# EAGLE design PID temperature controller (EAGLE 9.6.2)
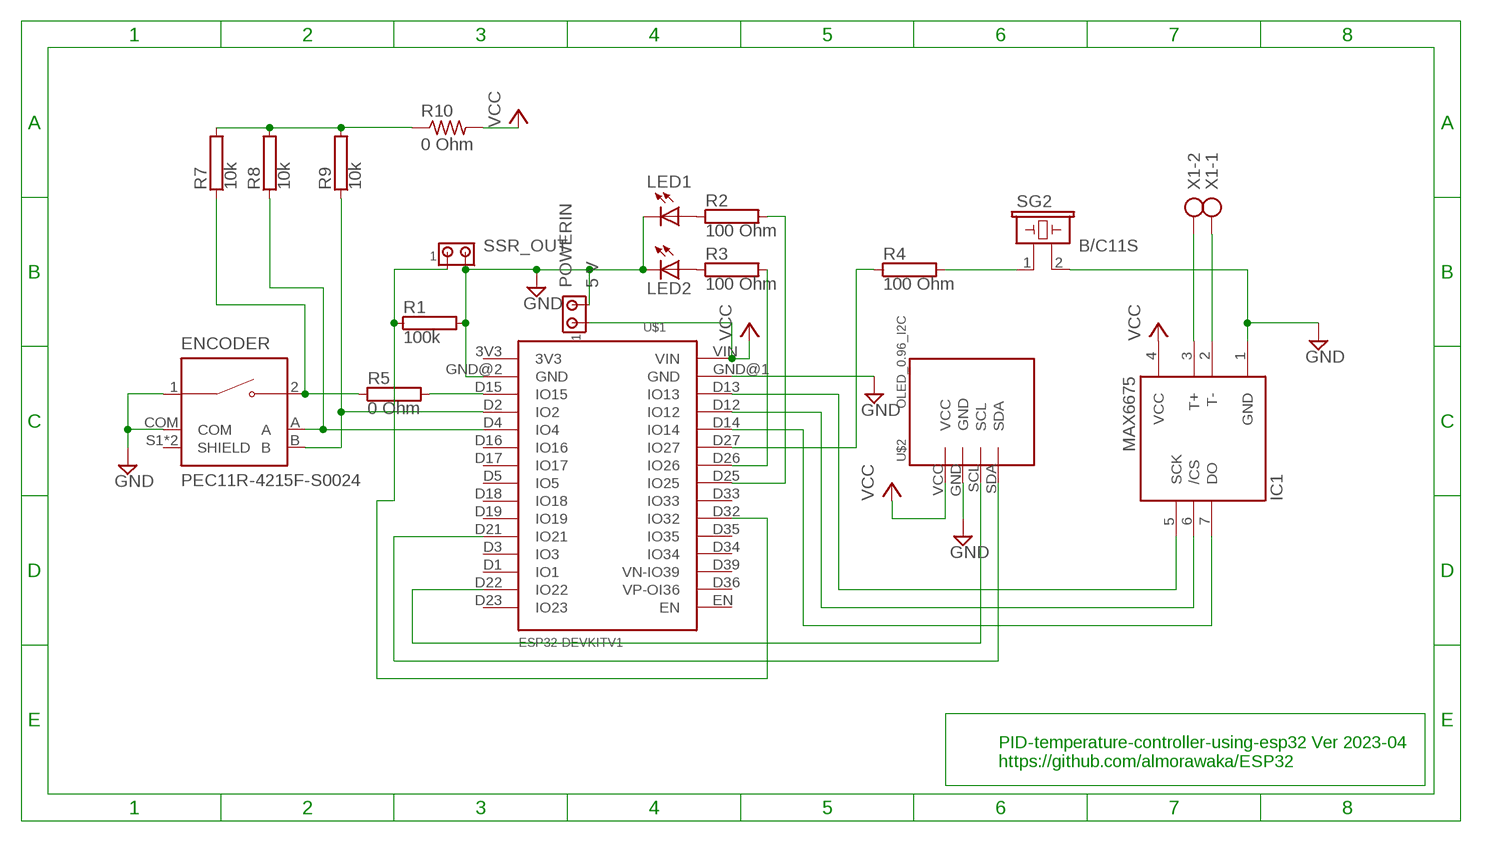
[diagram p0: schematic, sheet 1]

## Parts
ENCODER  PEC11R-4215F-S0024  [XDCR_PEC11R-4215F-S0024]
IC1  MAX6675  [SO08]
LED1  LED3MM  [LED3MM]
LED2  LED3MM  [LED3MM]
POWERIN  5 V  MTA02-100  [10X02MTA]
R1  100k  RRS1/8  [RS1/8]
R2  100 Ohm  RRS1/8  [RS1/8]
R3  100 Ohm  RRS1/8  [RS1/8]
R4  100 Ohm  RRS1/8  [RS1/8]
R5  0 Ohm  RRS1/8  [RS1/8]
R7  10k  RRS1/8  [RS1/8]
R8  10k  RRS1/8  [RS1/8]
R9  10k  RRS1/8  [RS1/8]
R10  0 Ohm  R-US_0207/12  [0207/12]
SG2  B/C11S  [B/C11S]
SSR_OUT  MTA02-100  [10X02MTA]
U$1  ESP32DEVKITV1  [ESP32-DEVKITV1]
U$2  OLED_0.96_I2C  [OLED_0.96_I2C]
X1  AK300/2  [AK300/2]

## Nets
GND: ENCODER.1 ENCODER.COM IC1.1(GND) LED1.K(C) LED2.K(C) POWERIN.2 R1.2 SG2.2 SSR_OUT.2 U$1.GND@1(GND) U$1.GND@2(GND) U$2.GND
N$1: IC1.7(DO) U$1.D14(IO14)
N$2: IC1.6(/CS) U$1.D12(IO12)
N$3: IC1.5(SCK) U$1.D13(IO13)
N$4: R4.1 U$1.D27(IO27)
N$5: IC1.3(T+) X1.2
N$6: IC1.2(T-) X1.1
N$7: U$1.D21(IO21) U$2.SDA
N$8: U$1.D22(IO22) U$2.SCL
N$9: R1.1 SSR_OUT.1 U$1.D32(IO32)
N$10: ENCODER.2 R5.1 R7.1
N$11: R5.2 U$1.D15(IO15)
N$13: LED1.A R2.1
N$14: LED2.A R3.1
N$15: R3.2 U$1.D26(IO26)
N$16: R2.2 U$1.D25(IO25)
N$17: R4.2 SG2.1
N$18: R7.2 R8.2 R9.2 R10.1
N$20: ENCODER.B R9.1 U$1.D2(IO2)
N$21: ENCODER.A R8.1 U$1.D4(IO4)
VCC: IC1.4(VCC) POWERIN.1 R10.2 U$1.VIN U$2.VCC
Unconnected: ENCODER.S1(SHIELD) ENCODER.S2(SHIELD) U$1.3V3 U$1.D1(IO1) U$1.D3(IO3) U$1.D5(IO5) U$1.D16(IO16) U$1.D17(IO17) U$1.D18(IO18) U$1.D19(IO19) U$1.D23(IO23) U$1.D33(IO33) U$1.D34(IO34) U$1.D35(IO35) U$1.D36(VP-OI36) U$1.D39(VN-IO39) U$1.EN

## Notes on the sheet
- PID-temperature-controller-using-esp32 Ver 2023-04
  https://github.com/almorawaka/ESP32

## Library data of the parts
ENCODER = rotary encoder:PEC11R-4215F-S0024: Incremental Encoder, 12 Mm, Contact Rating 10 Ma - 5 Vdc; DESCRIPTION: Rotary Encoder Mechanical 24 Quadrature (Incremental) Vertical; DIGI-KEY_PART_NUMBER: PEC11R-4215F-S0024-ND; MF: Bourns; MP: PEC11R-4215F-S0024; PACKAGE: None; PURCHASE-URL: https://pricing.snapeda.com/search/part/PEC11R-4215F-S0024/?ref=eda
IC1 = MAX6675:MAX6675: Check availability <https://pricing.snapeda.com/parts/MAX6675/Maxim%20Integrated/view-part?ref=eda>; AVAILABILITY: In Stock; DESCRIPTION: Temperature Sensor Development Tools Eval Kit MAX6675 (Cold-Junction-Compensated K-Thermocouple-to-DigitalConverter (0 C to +1024 C)); MF: Maxim Integrated; MP: MAX6675; PACKAGE: SOIC-8 Maxim; PRICE: None; PURCHASE-URL: https://pricing.snapeda.com/search/part/MAX6675/?ref=eda
LED1 LED2 = adafruit:LED: LED OSRAM: - CHIPLED LG R971, LG N971, LY N971, LG Q971, LY Q971, LO R971, LY R971 LH N974, LH R974 LS Q976, LO Q976, LY Q976 LO Q996 - Hyper CHIPLED LW Q18S LB Q993, LB Q99A, LB R99A - SideLED LS A670, LO A670, LY A670, LG A670, LP A670 LB A673, LV A673, LT A673, LW A673 LH A674 LY A675 LS A676, LA A676, LO A676, LY A676, LW A676 LS A679, LY A679, LG A679 - Hyper Micro SIDELED® LS Y876, LA Y876, LO Y876, LY Y876 LT Y87S - SmartLED LW L88C, LW L88S LB L89C, LB L89S, LG L890 LS L89K, LO L89K, LY L89K LS L896, LA L896, LO L896, LY L896 - TOPLED LS T670, LO T670, LY T670, LG T670, LP T670 LSG T670, LSP T670, LSY T670, LOP T670, LYG T670 LG T671, LOG T671, LSG T671 LB T673, LV T673, LT T673, LW T673 LH T674 LS T676, LA T676, LO T676, LY T676, LB T676, LH T676, LSB T676, LW T676 LB T67C, LV T67C, LT T67C, LS T67K, LO T67K, LY T67K, LW E67C LS E67B, LA E67B, LO E67B, LY E67B, LB E67C, LV E67C, LT E67C LW T67C LS T679, LY T679, LG T679 LS T770, LO T770, LY T770, LG T770, LP T770 LB T773, LV T773, LT T773, LW T773 LH T774 LS E675, LA E675, LY E675, LS T675 LS T776, LA T776, LO T776, LY T776, LB T776 LHGB T686 LT T68C, LB T68C - Hyper Mini TOPLED® LB M676 - Mini TOPLED Santana® LG M470 LS M47K, LO M47K, LY M47K Source: http://www.osram.convergy.de/
POWERIN SSR_OUT = con-amp:MTA02-100: AMP connector
R1-R5 R7-R9 = resistor-power:R: Power Resitor; OC_FARNELL: unknown; OC_NEWARK: unknown
R10 = adafruit:R-US_: RESISTOR, American symbol
SG2 = buzzer:B/C11S: BUZZER Source: Buerklin; OC_FARNELL: unknown; OC_NEWARK: unknown
U$1 = ESP32-DEVKITV1:ESP32DEVKITV1
U$2 = oled:OLED_0.96_I2C
X1 = con-ptr500:AK300/2: CONNECTOR; OC_FARNELL: unknown; OC_NEWARK: unknown

## Board
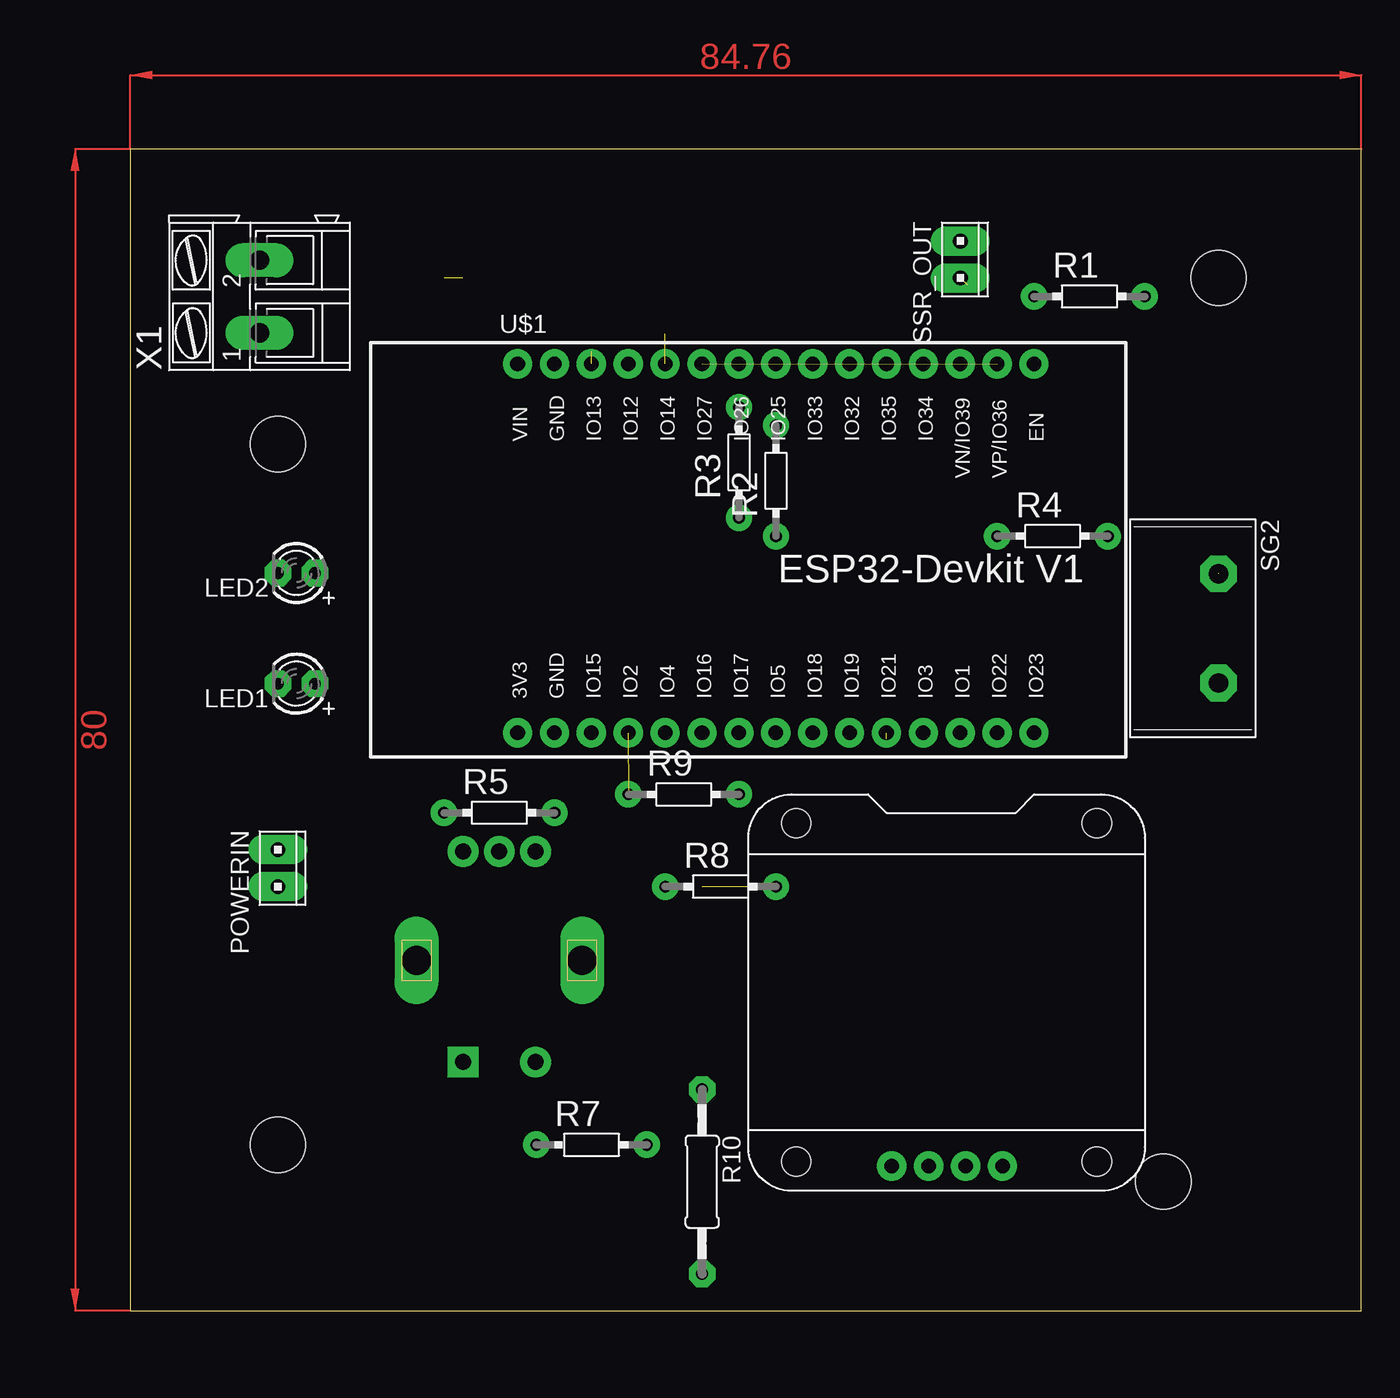
[diagram p1: board, top side]
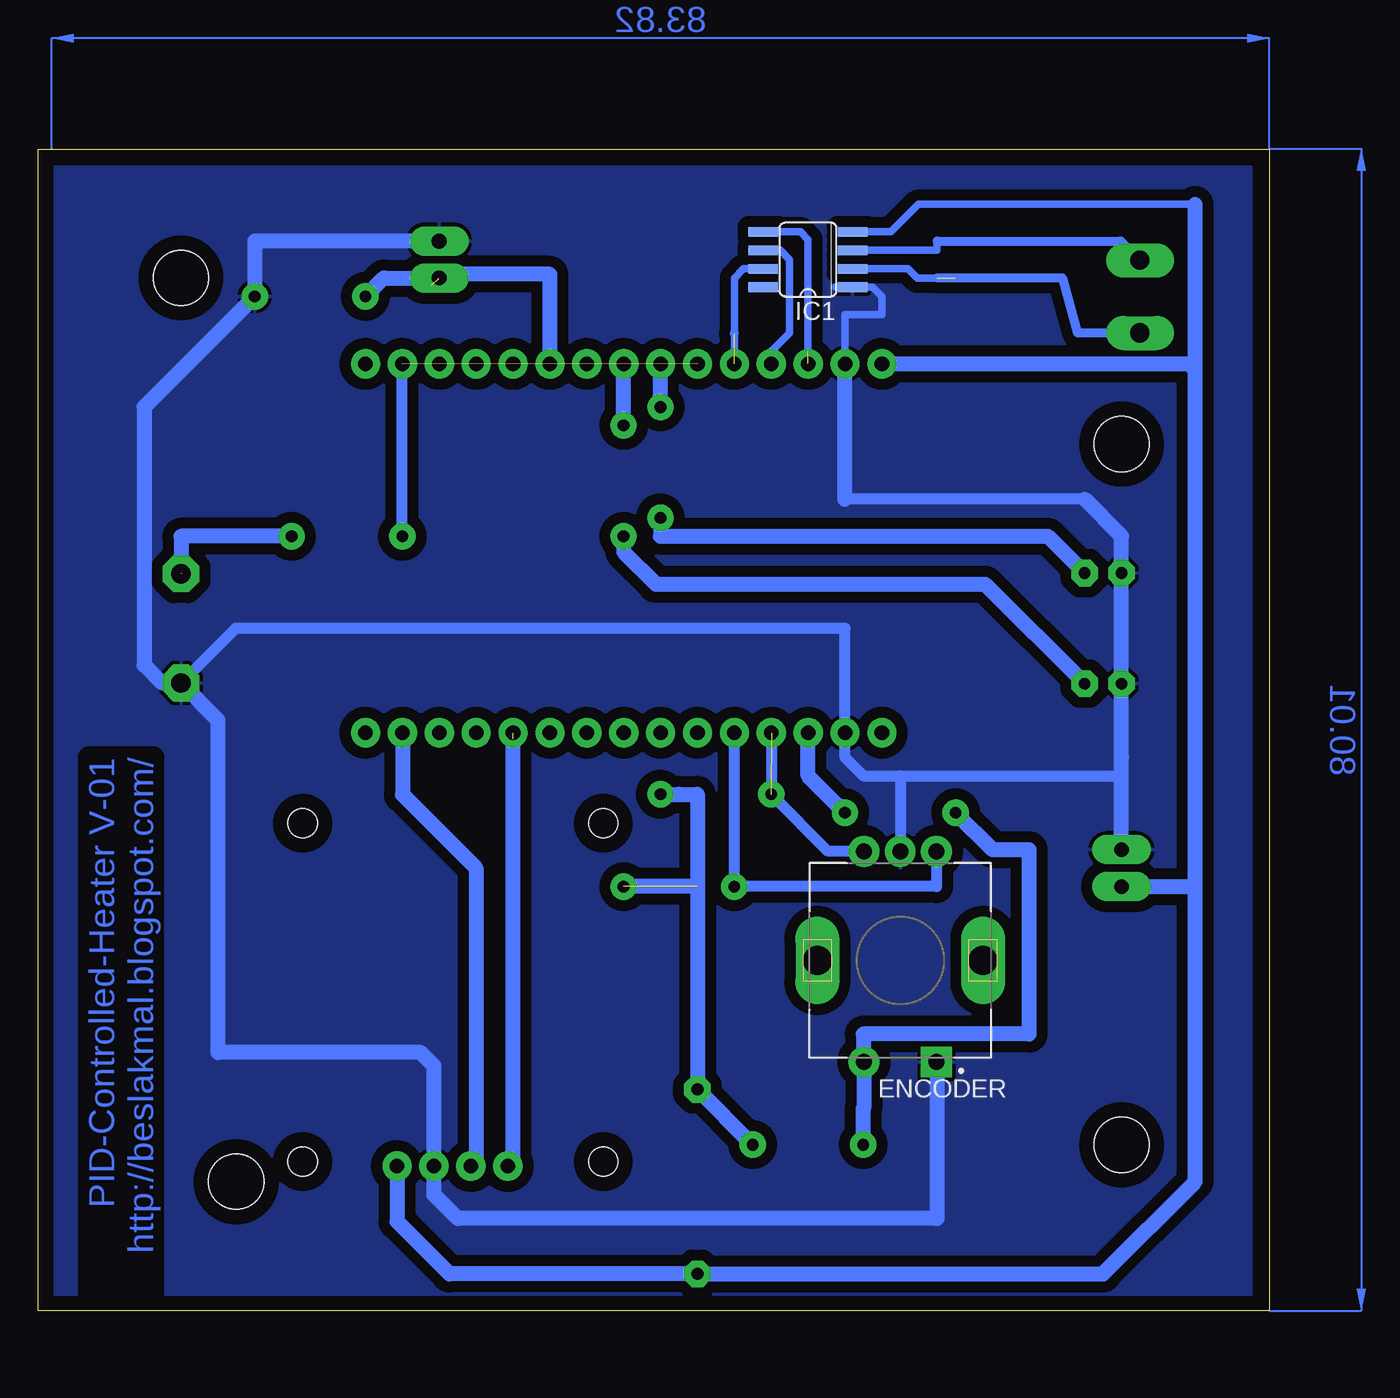
[diagram p2: board, bottom side, seen from below]

Size 84.76 x 80 mm. Coordinates in mm from the lower left corner, seen from the top.
Outline: 0,0 84.76,0 84.76,80 0,80 0,0
Copper layers (1*16): Top 0.035mm / dielectric 1.5mm / Bottom 0.035mm
Design rules "default *": minimum track width 40mil, minimum drill 0.35mm, track to track 30mil, track to pad 10mil, pad to pad 10mil, via to via 10mil, smd to smd 10mil, copper to edge 40mil, drill to drill 10mil, minimum pad ring 20mil, minimum via ring 20mil, stop-mask expansion 4mil, vias tented up to drill 0mil, thermal gap 10mil
Holes 3.81 mm at 71.12,8.89 74.93,71.12 10.16,59.69 10.16,11.43

### Footprints (pad centres in the part's own frame; a part is rotated, then mirrored left to right if it is on the bottom)
XDCR_PEC11R-4215F-S0024 = drill 1.1 square: 1 -2.5,7 | drill 1.1: 2 2.5,7; A -2.5,-7.5; B 2.5,-7.5; COM 0,-7.5 | drill 2 long: S1 -5.7,0; S2 5.7,0
SO08 = smd 0.66 x 2.032: 1 -1.905,-3.073; 2 -0.635,-3.073; 3 0.635,-3.073; 4 1.905,-3.073; 5 1.905,3.073; 6 0.635,3.073; 7 -0.635,3.073; 8 -1.905,3.073
LED3MM = drill 0.813 pad 1.676 octagon: A -1.27,0; K 1.27,0
10X02MTA = drill 1.016 long: 1 1.27,0; 2 -1.27,0
RS1/8 = drill 0.8 pad 1.4: 1 -3.81,0; 2 3.81,0
0207/12 = drill 0.813 pad 1.676 octagon: 1 -6.35,0; 2 6.35,0
B/C11S = drill 1.321 pad 2.54 octagon: 1 -3.759,0; 2 3.759,0
ESP32-DEVKITV1 = drill 1 pad 1.93: 3V3 -16.52,-12.27; D1 13.96,-12.27; D2 -8.9,-12.27; D3 11.42,-12.27; D4 -6.36,-12.27; D5 1.26,-12.27; D12 -8.9,13.135; D13 -11.44,13.135; D14 -6.36,13.135; D15 -11.44,-12.27; D16 -3.82,-12.27; D17 -1.28,-12.27; D18 3.8,-12.27; D19 6.34,-12.27; D21 8.88,-12.27; D22 16.5,-12.27; D23 19.04,-12.27; D25 1.26,13.135; D26 -1.28,13.135; D27 -3.82,13.135; D32 6.34,13.135; D33 3.8,13.135; D34 11.42,13.135; D35 8.88,13.135; D36 16.5,13.135; D39 13.96,13.135; EN 19.04,13.135; GND@1 -13.98,13.135; GND@2 -13.98,-12.27; VIN -16.52,13.135
OLED_0.96_I2C = drill 1 pad 1.778: GND -1.63,11.63; SCL 0.91,11.63; SDA 3.45,11.63; VCC -4.17,11.63 | hole 2: -10.67,-11.97; 10.03,-11.97; 10.03,11.33; -10.67,11.33
AK300/2 = drill 1.321 long: 1 -2.515,0; 2 2.489,0

### Placement (x,y rotation side)
ENCODER  25.4,24.13 180 bottom
IC1  31.75,72.39 90 bottom
LED1  11.43,43.18 180 top
LED2  11.43,50.8 180 top
POWERIN  10.16,30.48 270 top
R1  66.04,69.85 0 top
R2  44.45,57.15 90 top
R3  41.91,58.42 90 top
R4  63.5,53.34 0 top
R5  25.4,34.29 0 top
R7  31.75,11.43 0 top
R8  40.64,29.21 0 top
R9  38.1,35.56 0 top
R10  39.37,8.89 270 top
SG2  74.93,46.99 270 top
SSR_OUT  57.15,72.39 270 top
U$1  43.18,52.07 0 top
U$2  55.88,21.59 180 top
X1  8.89,69.85 90 top

### Tracks (layer width: path | path; a pad name or v marks a point on that pad's centre or on a via)
GND
  Bottom 0.508: 29.84,70.48 IC1.1 27.3,70.48 26.67,69.85 26.67,68.58 29.21,68.58 29.21,65.22 U$1.GND@1
  Bottom 0.61: LED2.K LED1.K | U$1.GND@2
  Bottom 0.762: 12.7,55.88 29.21,55.88 | 25.4,36.83 ENCODER.COM | SG2.2 71.17,46.99 29.21,46.99 29.2,46.98 U$1.GND@2 29.2,38.09 27.94,36.83 25.4,36.83 | 25.4,36.83 10.16,36.83 10.16,38.1 LED1.K
  Bottom 1.016: ENCODER.1 22.86,17.09 22.86,6.35 55.88,6.35 57.51,7.98 U$2.GND 57.51,16.87 58.42,17.78 72.39,17.78 72.39,40.69 SG2.2 76.25,43.23 77.47,44.45 77.47,62.23 R1.2 69.85,73.66 SSR_OUT.2 | 12.7,55.88 10.16,53.34 LED2.K POWERIN.2 10.16,38.1 | 29.21,55.88 29.21,65.22
  pour Bottom: 1.27,78.74 83.82,78.74 83.82,0 1.27,0
N$1  (2 unrouted)
  Bottom 0.508: IC1.7 36.2,71.75 36.83,71.12 36.83,65.22 U$1.D14 | 36.83,66.05 36.82,66.04
  Bottom 0.61: 36.82,67.3 36.83,67.31
N$2
  Bottom 0.508: IC1.6 33.66,73.03 33.02,72.39 33.02,67.3 34.28,66.04
  Bottom 0.61: U$1.D12 34.28,66.04 34.28,66.05
N$3  (1 unrouted)
  Bottom 0.508: IC1.5 32.28,74.3 31.75,73.76 31.75,66.04
N$4  (1 unrouted)
  Bottom 0.61: R4.1
  Bottom 0.762: R4.1 59.69,65.19
N$5
  Bottom 0.508: 22.86,73.66 22.86,73.03 IC1.3
  Bottom 0.61: 22.86,73.66 10.21,73.66 X1.2
N$6  (1 unrouted)
  Bottom 0.508: IC1.2 24.87,71.75 24.22,71.11 21.59,71.11
  Bottom 0.61: X1.1 13.2,67.33 14.25,71.12 22.86,71.12
N$7  (1 unrouted)
  Bottom 1.016: 52.63,10.16 U$2.SDA 52.07,10.32 52.07,39.37
N$8
  Bottom 1.016: U$2.SCL 54.61,10.32 54.61,30.48 59.68,35.55 U$1.D22
N$9  (1 unrouted)
  Bottom 1.016: U$1.D32 49.53,65.22 49.53,71.37 57.66,71.37 57.66,70.61 | R1.1 60.96,71.12 SSR_OUT.1
N$10
  Bottom 1.016: R7.1 27.94,13.93 27.9,13.97 27.9,16.51 | ENCODER.2 27.9,16.51 | R5.1 19.05,31.75 16.51,31.75 16.51,19.05 27.94,19.05 27.94,16.55 27.9,16.51
N$11
  Bottom 1.016: R5.2 31.75,36.83 U$1.D15
N$13
  Bottom 1.016: R2.1 44.45,52.26 42.23,50.04 19.56,50.04 LED1.A
N$14
  Bottom 1.016: R3.1 41.91,53.34 15.24,53.34 LED2.A
N$15
  Bottom 1.016: R3.2 U$1.D26
N$16
  Bottom 0.61: 44.44,64.77 U$1.D25
  Bottom 1.016: R2.2 44.44,64.77
N$17  (1 unrouted)
  Bottom 1.016: R4.2 74.93,53.34 74.93,50.8
N$18  (1 unrouted)
  Bottom 1.016: 39.37,29.21 39.37,35.56 R9.2 40.64,35.56 | 39.37,29.21 R8.2 | 39.37,29.21 | 39.37,29.21 R10.1 R7.2
N$20  (1 unrouted)
  Bottom 0.762: U$1.D2 R9.1 30.36,31.63 ENCODER.B
  Bottom 1.016: ENCODER.B 28.02,31.75
N$21
  Bottom 0.61: U$1.D4 36.82,39.37
  Bottom 0.762: ENCODER.A 22.9,29.21 R8.1 | R8.1 36.83,30.4 | R8.1 U$1.D4
  Bottom 1.016: 36.83,39.36 36.82,39.37 | 22.86,31.67 ENCODER.A
VCC
  Bottom 0.508: IC1.4 26.03,74.3 24.13,76.2 5.08,76.2
  Bottom 1.016: U$2.VCC 60.05,6.15 56.44,2.54 R10.2 11.43,2.54 5.08,8.89 5.08,29.21 | 5.08,29.21 5.08,64.77 | 5.08,64.77 5.08,76.2 | U$1.VIN 5.52,65.2 5.08,64.77 | POWERIN.1 5.08,29.21
(copper drawn outside any net)
  shapes: Bottom area x2, Top area x2

### Text on the board
Bottom: PID-Controlled-Heater V-01 / http://beslakmal.blogspot.com/